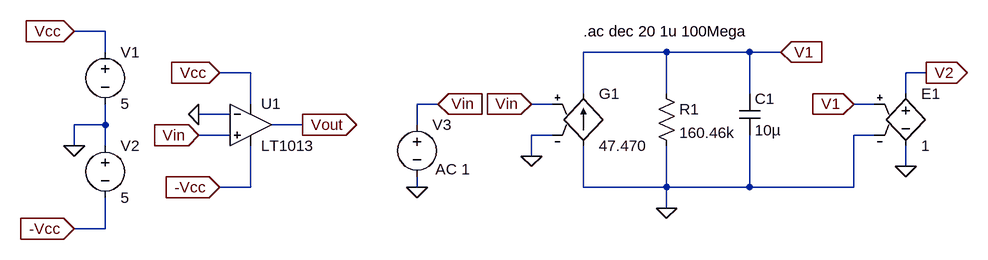
[diagram p0: schematic Q1.asc]
Q1.asc, the LTspice schematic file:
Version 4
SHEET 1 2832 680
WIRE 1488 224 1440 224
WIRE 1488 256 1488 224
WIRE 2352 256 2224 256
WIRE 2480 256 2352 256
WIRE 2528 256 2480 256
WIRE 1712 288 1664 288
WIRE 2752 288 2720 288
WIRE 2224 320 2224 256
WIRE 2352 320 2352 256
WIRE 2480 320 2480 256
WIRE 2720 320 2720 288
WIRE 1712 336 1712 288
WIRE 2000 336 1968 336
WIRE 2176 336 2144 336
WIRE 2672 336 2640 336
WIRE 1680 352 1632 352
WIRE 1488 368 1488 336
WIRE 1488 368 1440 368
WIRE 1792 368 1744 368
WIRE 1968 368 1968 336
WIRE 1680 384 1632 384
WIRE 2176 384 2144 384
WIRE 2672 384 2640 384
WIRE 1440 400 1440 368
WIRE 1488 400 1488 368
WIRE 2144 416 2144 384
WIRE 2720 432 2720 400
WIRE 1712 464 1712 400
WIRE 1712 464 1664 464
WIRE 1968 464 1968 448
WIRE 2224 464 2224 400
WIRE 2352 464 2352 400
WIRE 2352 464 2224 464
WIRE 2480 464 2480 384
WIRE 2480 464 2352 464
WIRE 2640 464 2640 384
WIRE 2640 464 2480 464
WIRE 2352 496 2352 464
WIRE 1488 528 1488 480
WIRE 1488 528 1440 528
FLAG 1440 400 0
FLAG 1968 464 0
FLAG 1632 352 0
FLAG 1440 224 Vcc
IOPIN 1440 224 In
FLAG 1440 528 -Vcc
IOPIN 1440 528 In
FLAG 2000 336 Vin
IOPIN 2000 336 In
FLAG 1632 384 Vin
IOPIN 1632 384 In
FLAG 1664 288 Vcc
IOPIN 1664 288 In
FLAG 1664 464 -Vcc
IOPIN 1664 464 In
FLAG 1792 368 Vout
IOPIN 1792 368 Out
FLAG 2144 336 Vin
IOPIN 2144 336 In
FLAG 2144 416 0
FLAG 2352 496 0
FLAG 2528 256 V1
IOPIN 2528 256 In
FLAG 2640 336 V1
IOPIN 2640 336 In
FLAG 2720 432 0
FLAG 2752 288 V2
IOPIN 2752 288 Out
SYMBOL opamps/LT1013 1712 304 R0
SYMATTR InstName U1
SYMBOL voltage 1488 240 R0
SYMATTR InstName V1
SYMATTR Value 5
SYMBOL voltage 1488 384 R0
SYMATTR InstName V2
SYMATTR Value 5
SYMBOL voltage 1968 352 R0
WINDOW 123 28 84 Left 2
SYMATTR Value2 AC 1
SYMATTR InstName V3
SYMATTR Value ""
SYMBOL g 2224 304 R0
SYMATTR InstName G1
SYMATTR Value 47.470
SYMBOL res 2336 304 R0
SYMATTR InstName R1
SYMATTR Value 160.46k
SYMBOL cap 2464 320 R0
SYMATTR InstName C1
SYMATTR Value 10µ
SYMBOL e 2720 304 R0
SYMATTR InstName E1
SYMATTR Value 1
TEXT 2224 224 Left 2 !.ac dec 20 1u 100Mega

The netlist it stands for:
* Q1.asc
XU1 Vin 0 Vcc -Vcc Vout LT1013  ; pins In+ In- V+ V- OUT
V1 Vcc 0 5
V2 0 -Vcc 5
V3 Vin 0 AC 1
G1 0 V1 Vin 0 47.470
R1 V1 0 160.46k
C1 V1 0 10µ
E1 V2 0 V1 0 1
.ac dec 20 1u 100Mega
.lib LTC.lib
.backanno
.end